# Altium schematic sheet Motor Driver.SchDoc: Motor Driver
size Tabloid; CompanyName: Vertex; Organization: Vertex Downhole Ltd.; Address1: 10911 50th Street SE; Address2: Calgary, AB; Address3: T2C 3E5; Address4: Canada; DocumentNumber: 550014; Revision: 4.1; SheetNumber: 8; SheetTotal: 8
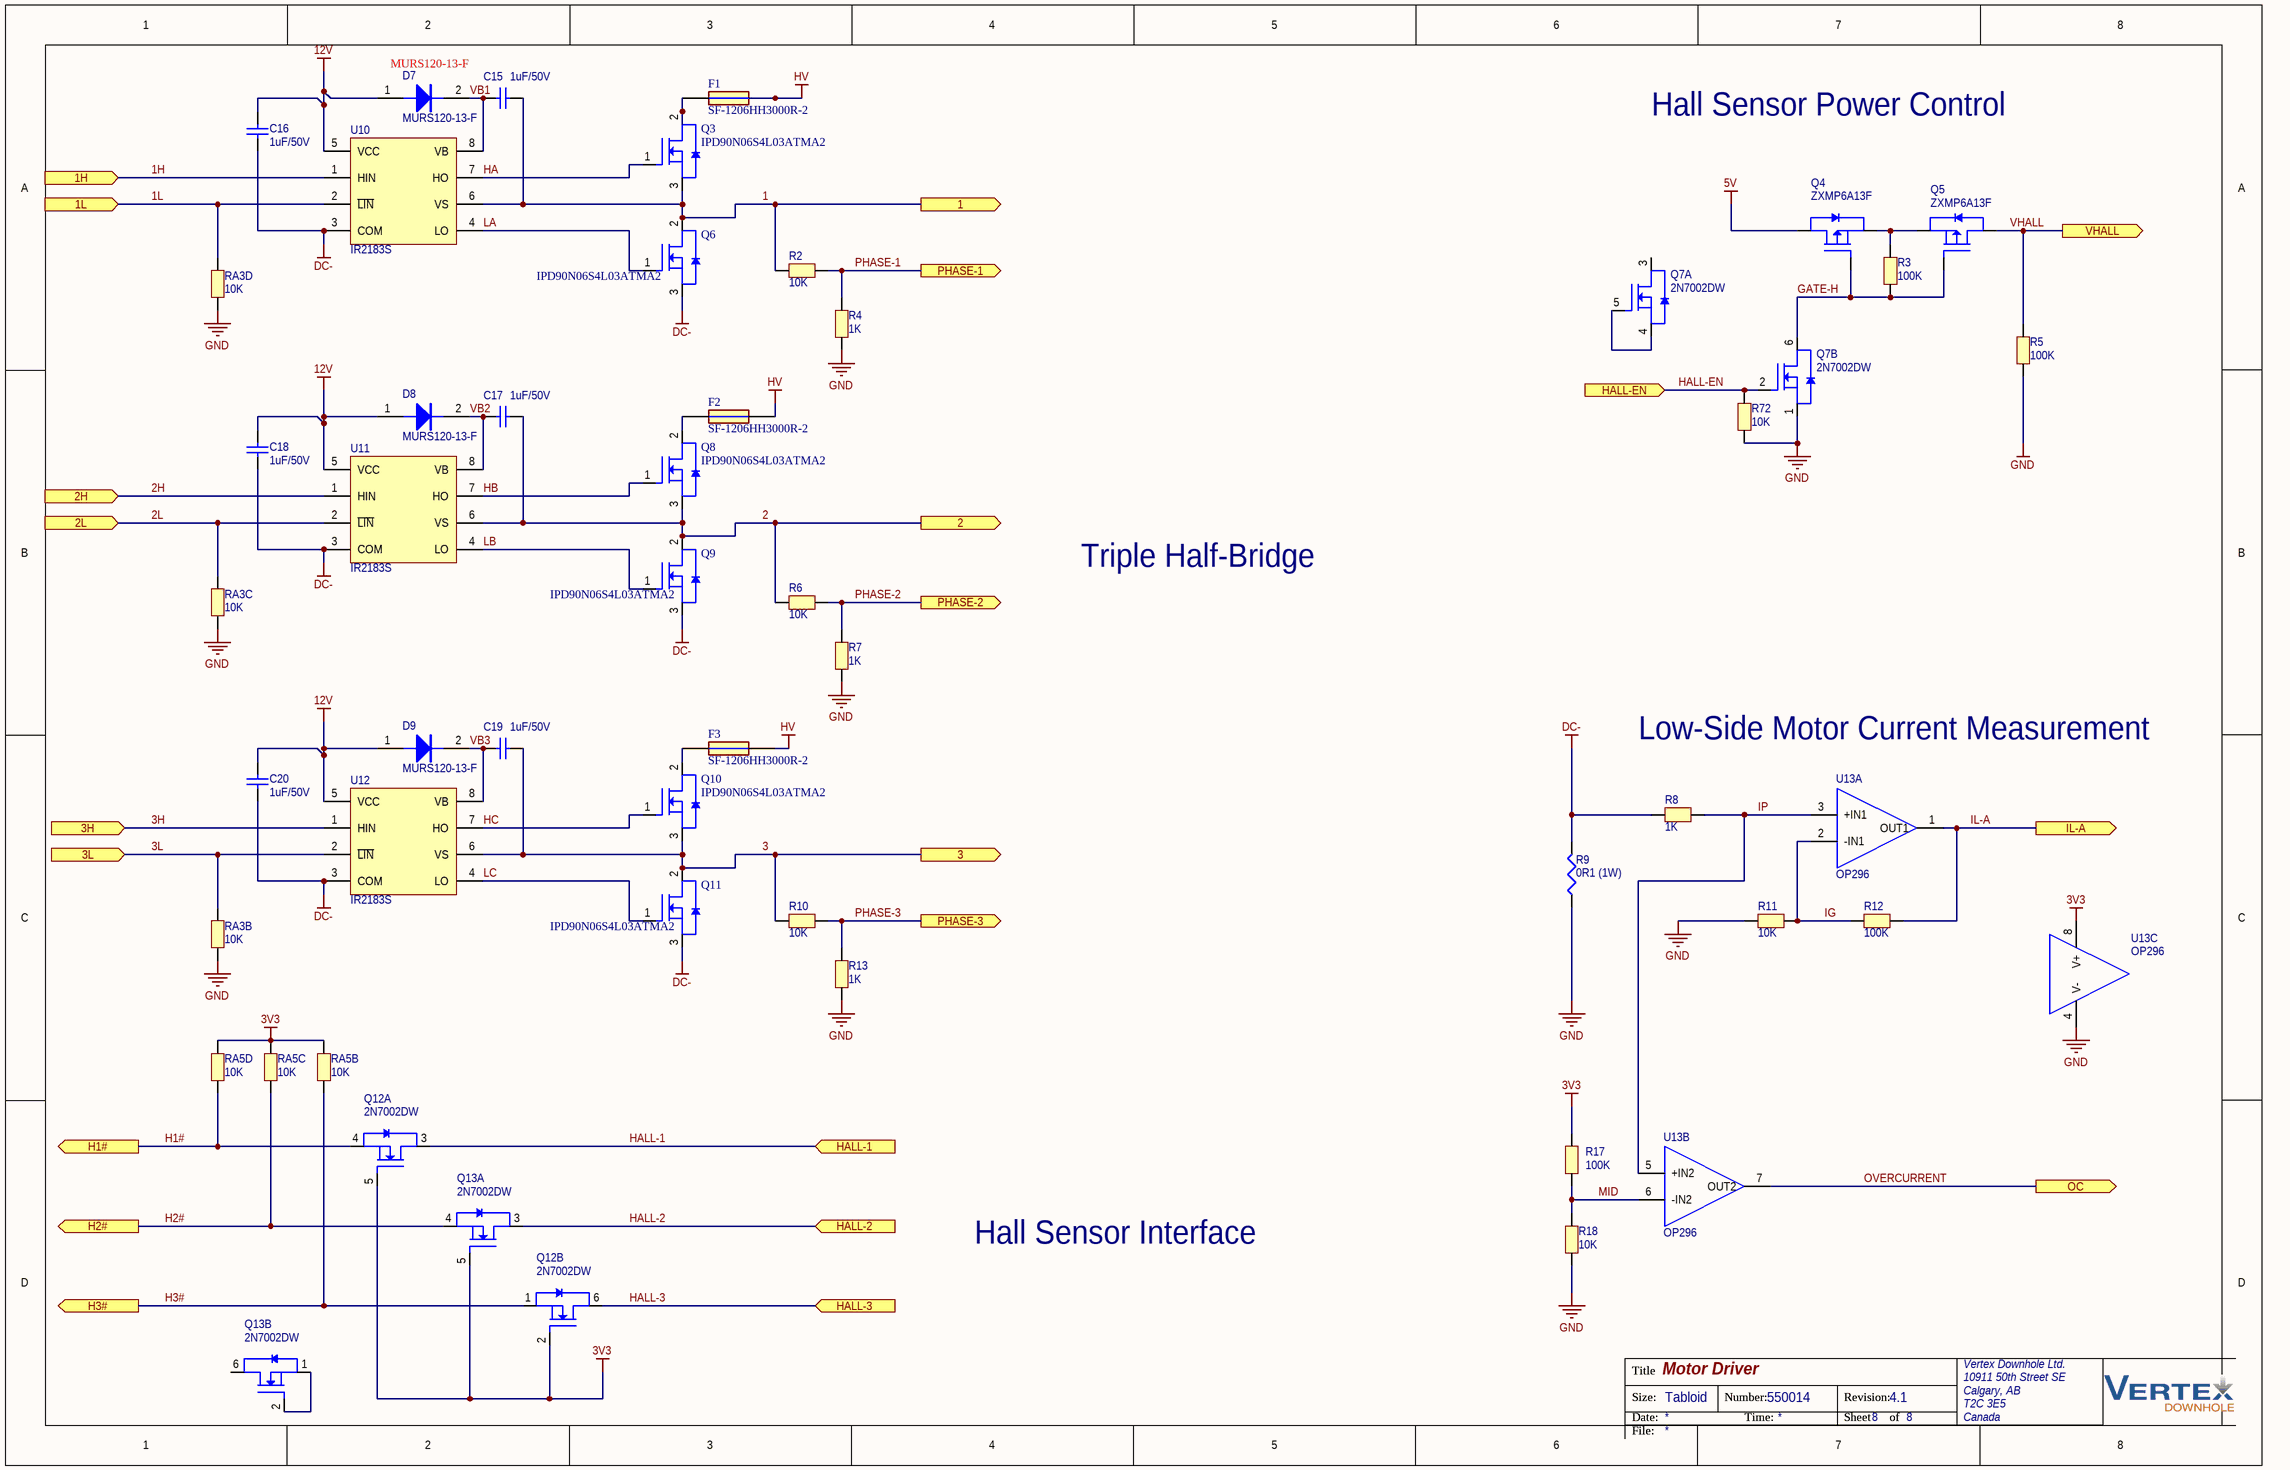
[diagram p0: Motor Driver.SchDoc]

## Parts
C15  1uF/50V  [1206-CR]
C16  1uF/50V  [1206-CR]
C17  1uF/50V  [1206-CR]
C18  1uF/50V  [1206-CR]
C19  1uF/50V  [1206-CR]
C20  1uF/50V  [1206-CR]
D7  MURS120-13-F  [SMB-D]
D8  MURS120-13-F  [SMB-D]
D9  MURS120-13-F  [SMB-D]
F1  SF-1206HH3000R-2  [SF1206HH3000R2]
F2  SF-1206HH3000R-2  [SF1206HH3000R2]
F3  SF-1206HH3000R-2  [SF1206HH3000R2]
Q3  IPD90N06S4L03ATMA2  [TO228P998X235-3N-2-V]
Q4  ZXMP6A13F  [DGS]
Q5  ZXMP6A13F  [SOT-23_DIO]
Q6  IPD90N06S4L03ATMA2  [TO228P998X235-3N-2-V]
Q7  2N7002DW  [DCK-6]  (parts A,B of 2)
Q8  IPD90N06S4L03ATMA2  [TO228P998X235-3N-2-V]
Q9  IPD90N06S4L03ATMA2  [TO228P998X235-3N-2-V]
Q10  IPD90N06S4L03ATMA2  [TO228P998X235-3N-2-V]
Q11  IPD90N06S4L03ATMA2  [TO228P998X235-3N-2-V]
Q12  2N7002DW  [DCK-6]  (parts A,B of 2)
Q13  2N7002DW  [DCK-6]  (parts A,B of 2)
R2  10K  [0805-CR]
R3  100K  [0805-CR]
R4  1K  [0805-CR]
R5  100K  [0805-CR]
R6  10K  [0805-CR]
R7  1K  [0805-CR]
R8  1K  [0805-CR]
R9  0R1 (1W)  [2512-CR]
R10  10K  [0805-CR]
R11  10K  [0805-CR]
R12  100K  [0805-CR]
R13  1K  [0805-CR]
R17  100K  [0805-CR]
R18  10K  [0805-CR]
R72  10K  [0805-CR]
RA3  10K  [742x083]  (parts B,C,D of 4)
RA5  10K  [742x083]  (parts B,C,D of 4)
U10  IR2183S  [D8]
U11  IR2183S  [D8]
U12  IR2183S  [D8]
U13  OP296  [D8]  (parts A,B,C of 3)

## Ports
1 (out), 1H (in), 1L (in), 2 (out), 2H (in), 2L (in), 3 (out), 3H (in), 3L (in), H1# (out), H2# (out), H3# (out), HALL-1 (in), HALL-2 (in), HALL-3 (in), HALL-EN (in), IL-A (out), OC (out), PHASE-1 (out), PHASE-2 (out), PHASE-3 (out), VHALL (out)

## Nets
3V3: Q12.2(G2) Q12.5(G1) Q13.5(G1) R17.2 RA5.3 RA5.5 RA5.7 U13.8(V+)
5V: Q4.3(D)
12V: C16.2 C18.2 C20.2 D7.1(A) D8.1(A) D9.1(A) U10.5(VCC) U11.5(VCC) U12.5(VCC)
DC-: C16.1 C18.1 C20.1 Q6.3(S) Q9.3(S) Q11.3(S) R8.1 R9.2 U10.3(COM) U11.3(COM) U12.3(COM)
GND: Q7.1(S2) R4.1 R5.2 R7.1 R9.1 R11.1 R13.1 R18.2 R72.2 RA3.4 RA3.6 RA3.8 U13.4(V-)
HV: F1.2 F2.2 F3.2
1: C15.1 Q3.3(S) Q6.2(D) R2.1 U10.6(VS) ; port 1
1H: U10.1(HIN) ; port 1H
1L: RA3.7 U10.2(~{LIN}) ; port 1L
2: C17.1 Q8.3(S) Q9.2(D) R6.1 U11.6(VS) ; port 2
2H: U11.1(HIN) ; port 2H
2L: RA3.5 U11.2(~{LIN}) ; port 2L
3: C19.1 Q10.3(S) Q11.2(D) R10.1 U12.6(VS) ; port 3
3H: U12.1(HIN) ; port 3H
3L: RA3.3 U12.2(~{LIN}) ; port 3L
GATE-H: Q4.1(G) Q5.1(G) Q7.6(D2) R3.1
H1#: Q12.4(S1) RA5.8 ; port H1#
H2#: Q13.4(S1) RA5.6 ; port H2#
H3#: Q12.1(S2) RA5.4 ; port H3#
HA: Q3.1(G) U10.7(HO)
HALL-1: Q12.3(D1) ; port HALL-1
HALL-2: Q13.3(D1) ; port HALL-2
HALL-3: Q12.6(D2) ; port HALL-3
HALL-EN: Q7.2(G2) R72.1 ; port HALL-EN
HB: Q8.1(G) U11.7(HO)
HC: Q10.1(G) U12.7(HO)
IG: R11.2 R12.1 U13.2(-IN1)
IL-A: R12.2 U13.1(OUT1) ; port IL-A
IP: R8.2 U13.3(+IN1) U13.5(+IN2)
LA: Q6.1(G) U10.4(LO)
LB: Q9.1(G) U11.4(LO)
LC: Q11.1(G) U12.4(LO)
MID: R17.1 R18.1 U13.6(-IN2)
OVERCURRENT: U13.7(OUT2) ; port OC
PHASE-1: R2.2 R4.2 ; port PHASE-1
PHASE-2: R6.2 R7.2 ; port PHASE-2
PHASE-3: R10.2 R13.2 ; port PHASE-3
VB1: C15.2 D7.2(K) U10.8(VB)
VB2: C17.2 D8.2(K) U11.8(VB)
VB3: C19.2 D9.2(K) U12.8(VB)
VHALL: Q5.3(D) R5.1 ; port VHALL
NetF1_1: F1.1 Q3.2(D)
NetF2_1: F2.1 Q8.2(D)
NetF3_1: F3.1 Q10.2(D)
NetQ4_2: Q4.2(S) Q5.2(S) R3.2
NetQ7_4: Q7.4(S1) Q7.5(G1)
NetQ13_1: Q13.1(S2) Q13.2(G2)

Not connected (* = marked no-connect by the designer): Q7 3(D1); Q13 6(D2)

## Notes on the sheet
- MURS120-13-F
- Hall Sensor Power Control
- Triple Half-Bridge
- Low-Side Motor Current Measurement
- Hall Sensor Interface
- Title
- Size:
- Date:
- Tabloid
- Number:
- Time:
- Revision:
- Sheet
- of
- File:

## Library data of the parts
C15-C20 = Cap: Capacitor; Manufacturer: Murata Electronics North America; Vendor: Digi-Key; Vendor PN: 490-4795-1-ND; Manu PN: GCM31MR71H105KA55L; Vertex PN: 6221004
D7-D9 = DIODE_1: Diode; Manufacturer: Diodes Inc.; Vendor: Digi-Key; Vendor PN: MURS120-FDITR-ND; Vertex PN: 6600001-01; Manu PN: MURS120-13-F
F1-F3 = SF-1206HH3000R-2: 1206 high-current met-foil. 30A; Manufacturer_Name: Bourns; Geometry.Height: 1.2mm; Mouser Part Number: 652-SF-1206HH3000R-2; Mouser Price/Stock: https://www.mouser.co.uk/ProductDetail/Bourns/SF-1206HH3000R-2?qs=Imq1NPwxi749RSSbSyFccA%3D%3D; Manufacturer_Part_Number: SF-1206HH3000R-2; Datasheet Link: https://www.bourns.com/docs/Product-Datasheets/SF-1206HH-R.pdf
Q3 Q6 Q8-Q11 = IPD90N06S4L03ATMA2: MOSFET N-CH 60V 90A TO252-31; Manufaturer: Infineon; Vendor: Digi-Key; Vendor PN: 448-IPD90N06S4L03ATMA2CT-ND; Manu PN: IPD90N06S4L03ATMA2
Q4 Q5 = Si2323DS: ZXMP6A13F 60V P-channel FET; Manufacturer: Diodes/Zetex; Manu PN: ZXMP6A13FTA; Vendor: Digi-Key; Vendor PN: ZXMP6A13FCT-ND; Vertex PN: 6500003
Q7 Q12 Q13 = 2N7002DW: 2N7002DW Dual N-Channel FET SC-70-6; Manufacturer: Fairchild Semiconductor; Vendor PN: 2N7002DWCT-ND; Vendor: Digi-Key; Vertex PN: 6500000; Manu PN: 2N7002DW
R2 R3 R6 R10 R11 R18 R72 = RES: Resistor; Manufacturer: Yageo; Vendor PN: 311-10.0KCRCT-ND; Vendor: Digi-Key; Manu PN: RC0805FR-0710KL; Vertex PN: 6181002
R4 R7 R8 R13 = RES: Resistor; Manufacturer: Yageo; Vendor PN: 311-1.00KCRCT-ND; Vendor: Digi-Key; Manu PN: RC0805FR-071KL; Vertex PN: 6180102
R5 R12 R17 = RES: Resistor; Manufacturer: Yageo; Vendor PN: 311-100KCRCT-ND; Vendor: Digi-Key; Manu PN: RC0805FR-07100KL; Vertex PN: 6181003
R9 = RES1: RES 0.1 OHM 1% 1W 2512; Manufacturer: Vishay/Dale; Vendor: Digi-Key; Vendor PN: WSLG-.10CT-ND; Manu PN: WSL2512R1000FEA; Vertex PN: 6150001
RA3 RA5 = 742x083: 742 4-Isolated 50V (0603x4) Resistor Array; Manufacturer: CTS Resistor Products; Vendor PN: 742C083103JPCT-ND; Vendor: Digi-Key; Manu PN: 742C083103JP; Vertex PN: 6108103
U10-U12 = IR2183S: IR2183S Dual High/Low Side FET Driver; Manufacturer: International Rectifier; Vendor PN: IR2183SPBFCT-ND; Manu PN: IR2183STRPBF; Vendor: Digi-Key; Vertex PN: 6400005
U13 = OP296: OP296 Micropower Op Amp; Manufacturer: Analog Devices Inc; Vendor: Digi-Key; Vendor PN: OP296GSZ-ND; Manu PN: OP296GSZ; Vertex PN: 6400010